# EAGLE schematic sensorFreezer (EAGLE 9.6.2)
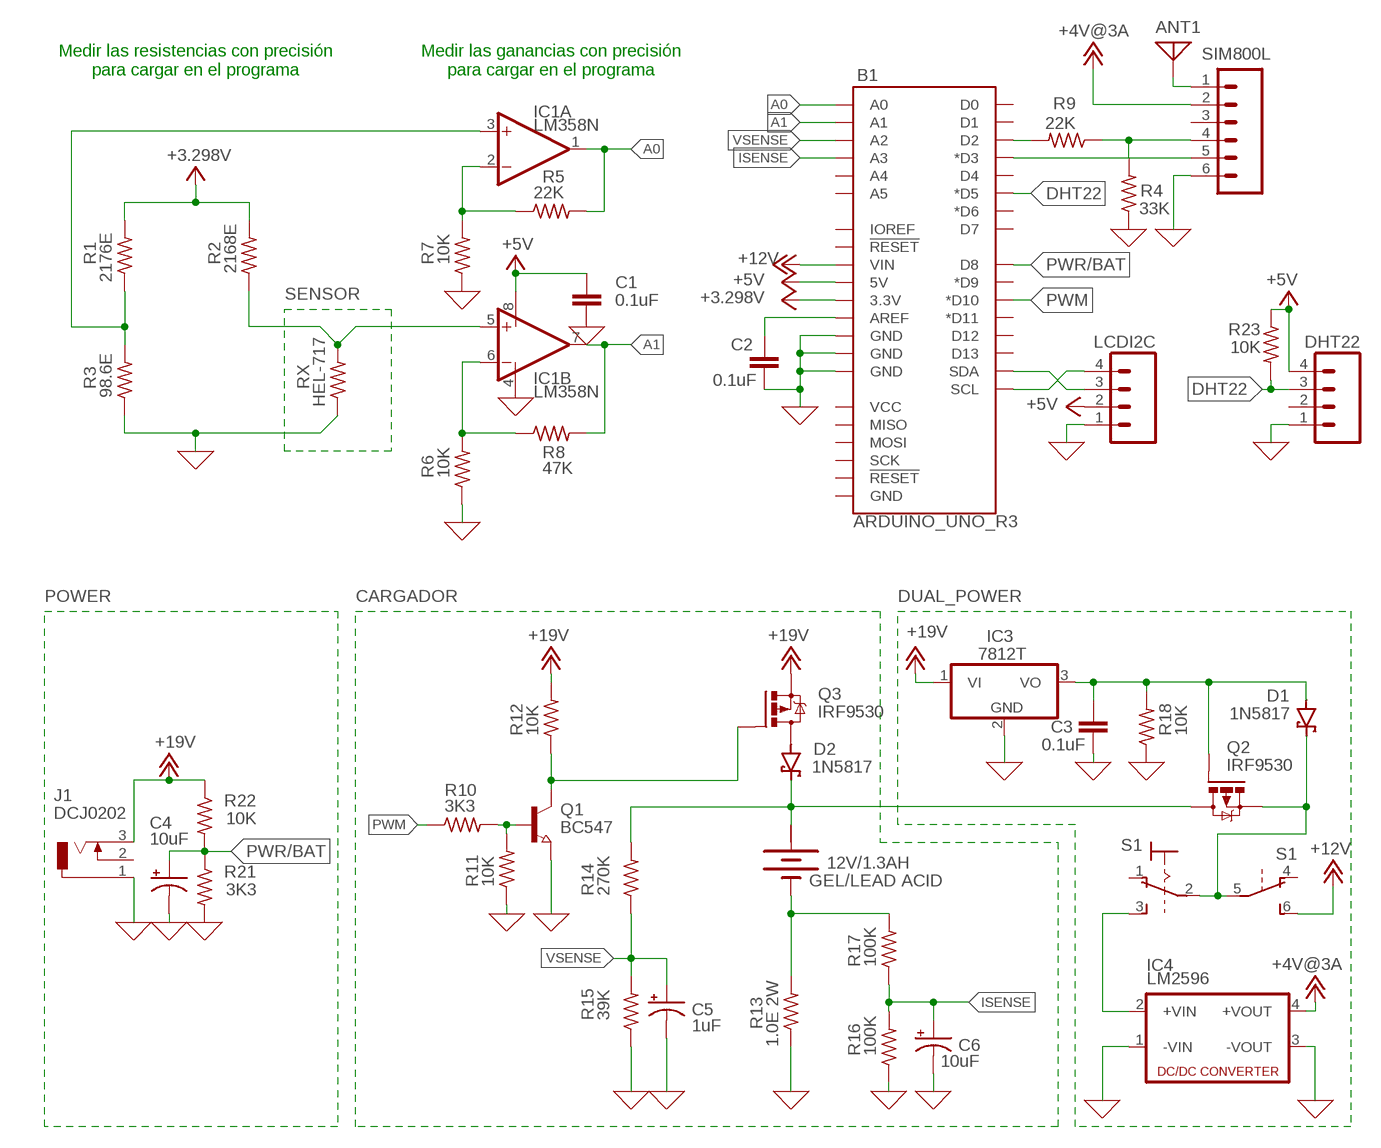
[diagram p0: schematic, sheet 1]

## Parts
12V/1.3AH  GEL/LEAD ACID  BATTERY  [BATTERY]
ANT1  ANTENNA  [PAD-01]
B1  ARDUINO_UNO_R3  [ARDUINO_R3]
C1  0.1uF  C2,5-3  [C2.5-3]
C2  0.1uF  C2,5-3  [C2.5-3]
C3  0.1uF  C2,5-3  [C2.5-3]
C4  10uF  CPOL-US085CS-1AR  [085CS_1AR]
C5  1uF  CPOL-US085CS-1AR  [085CS_1AR]
C6  10uF  CPOL-US085CS-1AR  [085CS_1AR]
D1  1N5817  1N5819-B  [DO41-7.6]
D2  1N5817  1N5819-B  [DO41-7.6]
DHT22  M04  [04P]
IC1  LM358N  [DIL08]
IC3  7812T  [TO220H]
IC4  LM2596  NME  [NME]
J1  DCJ0202  [DCJ0202]
LCDI2C  M04  [04P]
Q1  BC547  NPN-TRANSISTOR_SOT23  [SOT23]
Q2  IRF9530  [TO220BV]
Q3  IRF9530  [TO220BV]
R1  2176E  R-US_0204/5  [0204/5]
R2  2168E  R-US_0204/5  [0204/5]
R3  98.6E  R-US_0204/5  [0204/5]
R4  33K  R-US_0204/5  [0204/5]
R5  22K  R-US_0204/5  [0204/5]
R6  10K  R-US_0204/5  [0204/5]
R7  10K  R-US_0204/5  [0204/5]
R8  47K  R-US_0204/5  [0204/5]
R9  22K  R-US_0204/5  [0204/5]
R10  3K3  R-US_0204/5  [0204/5]
R11  10K  R-US_0204/5  [0204/5]
R12  10K  R-US_0204/5  [0204/5]
R13  1.0E 2W  R-US_0204/5  [0204/5]
R14  270K  R-US_0204/5  [0204/5]
R15  39K  R-US_0204/5  [0204/5]
R16  100K  R-US_0204/5  [0204/5]
R17  100K  R-US_0204/5  [0204/5]
R18  10K  R-US_0204/5  [0204/5]
R21  3K3  R-US_0204/5  [0204/5]
R22  10K  R-US_0204/5  [0204/5]
R23  10K  R-US_0204/5  [0204/5]
RX  HEL-717  R-US_0204/5  [0204/5]
S1  320-938  [320-938]
SIM800L  M06  [06P]

## Nets
0: B1.GND@2(GND) B1.GND@3(GND) B1.GND@4(GND) C1.2 C2.2 C3.2 C4.- C5.- C6.- DHT22.1 IC1.4(P:V-) IC3.2(GND) IC4.1(-VIN) IC4.3(-VOUT) J1.1 LCDI2C.1 Q1.2(E) R3.1 R4.1 R6.1 R7.1 R11.1 R13.1 R15.1 R16.1 R18.1 R21.2 RX.1 SIM800L.6 ; supply symbol labelled GND
+3V3: B1.3.3V R1.2 R2.2 ; supply symbol labelled +3.298V
+5V: B1.5V C1.1 DHT22.4 IC1.8(P:V+) LCDI2C.2 R23.1
+12V: B1.VIN IC3.1(VI) IC4.4(+VOUT) J1.3 Q3.S R12.2 R22.1 S1.6(B:S) SIM800L.2 ; supply symbol labelled +4V@3A, +19V
A0: B1.A0 IC1.1(A:OUT) R5.2
A1: B1.A1 IC1.7(B:OUT) R8.2
DHT22: B1.D5(*D5) DHT22.3 R23.2
ISENSE: B1.A3 C6.+ R16.2 R17.1
N$1: IC1.6(B:-IN) R6.2 R8.1
N$2: IC1.5(B:+IN) R2.1 RX.2
N$3: IC1.3(A:+IN) R1.1 R3.2
N$4: IC1.2(A:-IN) R5.1 R7.2
N$5: B1.AREF C2.1
N$6: B1.SDA LCDI2C.3
N$7: B1.SCL LCDI2C.4
N$8: B1.D2 R9.2
N$9: C3.1 D1.A IC3.3(VO) Q2.G R18.2
N$10: R4.2 R9.1 SIM800L.4
N$11: B1.D3(*D3) SIM800L.5
N$12: ANT1.1 SIM800L.1
N$14: Q1.1(B) R10.2 R11.2
N$15: Q1.3(C) Q3.G R12.1
N$16: D2.A Q3.D
N$17: 12V/1.3AH.+ D2.C Q2.D R14.2
N$18: 12V/1.3AH.- R13.2 R17.2
N$19: IC4.2(+VIN) S1.3(1:S)
N$21: D1.C Q2.S S1.2(1:P) S1.5(B:P)
PWM: B1.D10(*D10) R10.1
PWR/BAT: B1.D8 C4.+ R21.1 R22.2
VSENSE: B1.A2 C5.+ R14.1 R15.2
Unconnected: B1.A4 B1.A5 B1.D0 B1.D1 B1.D4 B1.D6(*D6) B1.D7 B1.D9(*D9) B1.D11(*D11) B1.D12 B1.D13 B1.GND@1(GND) B1.IOREF B1.MISO B1.MOSI B1.RESET@1(!RESET!) B1.RESET@2(!RESET!) B1.SCK B1.VCC DHT22.2 J1.2 S1.1(1:O) S1.4(B:O) SIM800L.3

## Notes on the sheet
- Medir las resistencias con precisión
  para cargar en el programa
- Medir las ganancias con precisión
  para cargar en el programa

## Power pins joined to a net without a drawn wire
+: 12V/1.3AH.+@1(+)

## Library data of the parts
12V/1.3AH = special:BATTERY: BATTERY
ANT1 = discrete:ANTENNA: Antenna
B1 = SparkFun-Boards:ARDUINO_UNO_R3: Arduino R3 Footprint with SPI header Arduino Uno R3 Compatible Footprint. Matches PCB size of the original board. SparkFun Products: SAMD21 Dev Breakout <https://www.sparkfun.com/products/13672> RedBoard <https://www.sparkfun.com/products/12757> R3 Stackable Headers <https://www.sparkfun.com/products/11417>
C1-C3 = capacitor-wima:C: CAPACITOR naming: grid - package width
C4-C6 = rcl:CPOL-US: POLARIZED CAPACITOR, American symbol; SPICEPREFIX: C
D1 D2 = diode:1N581*: 1.0A SCHOTTKY BARRIER RECTIFIER Source: http://www.diodes.com/datasheets/ds23001.pdf
DHT22 LCDI2C = con-amp-quick:M04: AMP QUICK CONNECTOR; OC_FARNELL: unknown; OC_NEWARK: unknown
IC1 = linear:LM358: OP AMP also LM158; LM258; LM2904 Source: http://cache.national.com/ds/LM/LM158.pdf
IC3 = linear:78*: Positive VOLTAGE REGULATOR Source: http://cache.national.com/ds/LM/LM78L05.pdf http://www.fairchildsemi.com/ds/LM/LM7805.pdf
IC4 = dc-dc-converter:NME: DC-DC CONVERTER; MF: C & D TECHNOLOGIES, INC; MPN: NME1205D; OC_FARNELL: 1021466; OC_NEWARK: 98B8198
J1 = con-jack:DCJ0202: DC POWER JACK Source: DCJ0202.pdf; OC_FARNELL: unknown; OC_NEWARK: unknown
Q1 = semicon-smd-ipc:NPN-TRANSISTOR_: NPN TRANSISTOR
Q2 Q3 = transistor-power:IRF9530: P-CHANNEL HEXFET POWER-MOS-FET Source: http://www.irf.com/product-info/datasheets/data/irf9530.pdf
R1-R18 R21-R23 RX = rcl:R-US_: RESISTOR, American symbol; SPICEPREFIX: R
S1 = switch:320-938: TOGGLE SWITCH distributor RS Components
SIM800L = con-amp-quick:M06: AMP QUICK CONNECTOR; OC_FARNELL: unknown; OC_NEWARK: unknown